# EAGLE design LUMINA BOARD (EAGLE 7.5.0)
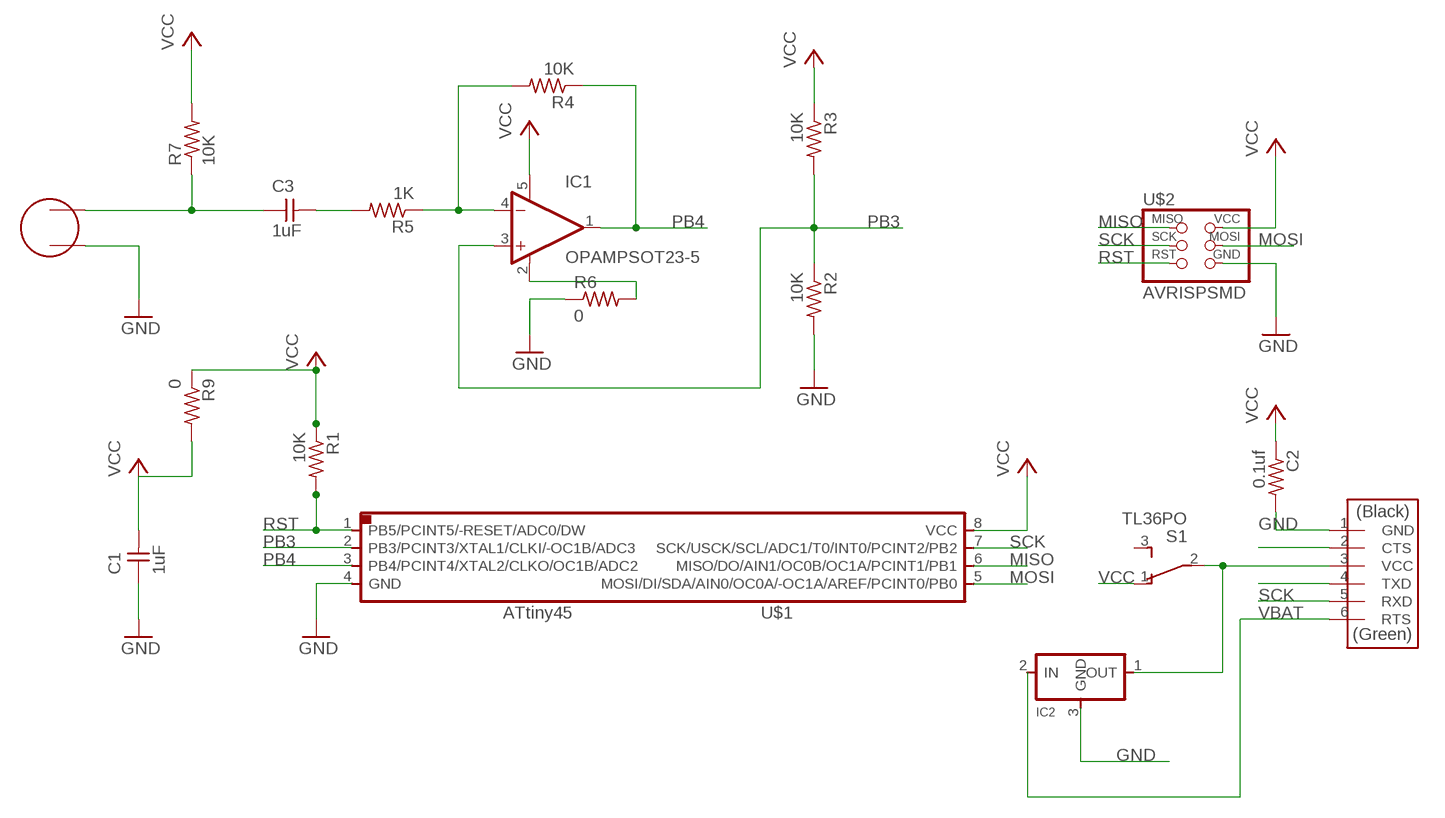
[diagram p0: schematic, sheet 1]

## Parts
C1  1uF  UNPOLARIZED_CAPACITOR1206  [1206]
C2  0.1uf  RESISTOR1206  [1206]
C3  1uF  UNPOLARIZED_CAPACITOR1206  [1206]
IC1  OPAMPSOT23-5  [SOT23-5]
IC2  REGULATORSOT23  [SOT23]
R1  10K  RESISTOR1206  [1206]
R2  10K  RESISTOR1206  [1206]
R3  10K  RESISTOR1206  [1206]
R4  10K  RESISTOR1206  [1206]
R5  1K  RESISTOR1206  [1206]
R6  0  RESISTOR1206  [1206]
R7  10K  RESISTOR1206  [1206]
R9  0  RESISTOR1206  [1206]
S1  TL36PO  [TL3XPO]
U$1  ATTINY45SI  [SOIC8]
U$2  AVRISPSMD  [2X03SMD]
U$3  FTDI-SMD-HEADER  [1X06SMD]
U$4  ELECTRET  [ELECTRET_2742PBJ-A]

## Nets
GND: C1.1 C2.2 IC2.3(GND) R2.2 R6.1 U$1.4(GND) U$2.6(GND) U$3.1(GND) U$4.P$1
MISO: U$1.6(MISO/DO/AIN1/OC0B/OC1A/PCINT1/PB1) U$2.1(MISO)
MOSI: U$1.5(MOSI/DI/SDA/AIN0/OC0A/-OC1A/AREF/PCINT0/PB0) U$2.4(MOSI)
N$1: C3.1 R7.1 U$4.P$2
N$2: C3.2 R5.2
N$3: IC1.4(-IN) R4.2 R5.1
N$5: IC1.2(V-) R6.2
N$6: U$3.2(CTS)
N$7: IC2.1(OUT) S1.2(P) U$3.3(VCC)
N$8: U$3.4(TXD)
PB3: IC1.3(+IN) R2.1 R3.2 U$1.2(PB3/PCINT3/XTAL1/CLKI/-OC1B/ADC3)
PB4: IC1.1(OUT) R4.1 U$1.3(PB4/PCINT4/XTAL2/CLKO/OC1B/ADC2)
RST: R1.2 U$1.1(PB5/PCINT5/-RESET/ADC0/DW) U$2.5(RST)
SCK: U$1.7(SCK/USCK/SCL/ADC1/T0/INT0/PCINT2/PB2) U$2.3(SCK) U$3.5(RXD)
VBAT: IC2.2(IN) U$3.6(RTS)
VCC: C1.2 C2.1 IC1.5(V+) R1.1 R3.1 R7.2 R9.1 R9.2 S1.1(O) U$1.8(VCC) U$2.2(VCC)
Unconnected: S1.3(S)

## Library data of the parts
C1 C3 = 01_FAB_Hello:UNPOLARIZED_CAPACITOR: unpolarized_capacitor
C2 R1-R7 R9 = 01_FAB_Hello:RESISTOR
IC1 = fab:OPAMP: Rail-to-Rail Operational Amplifiers Single-Supply, MicroAmplifier(TM) Series
IC2 = fab:REGULATOR
S1 = switch:TL36PO: TINY SWITCH ON - ON Source: http://www2.produktinfo.conrad.com/datenblaetter/700000-724999/705152-da-01-de-Subminiaturschalter_TL_36YO.pdf
U$1 = 01_fab:ATTINY45
U$2 = 01_FAB_Hello:AVRISP
U$3 = fab:FTDI-SMD-HEADER
U$4 = fab:ELECTRET

## Board
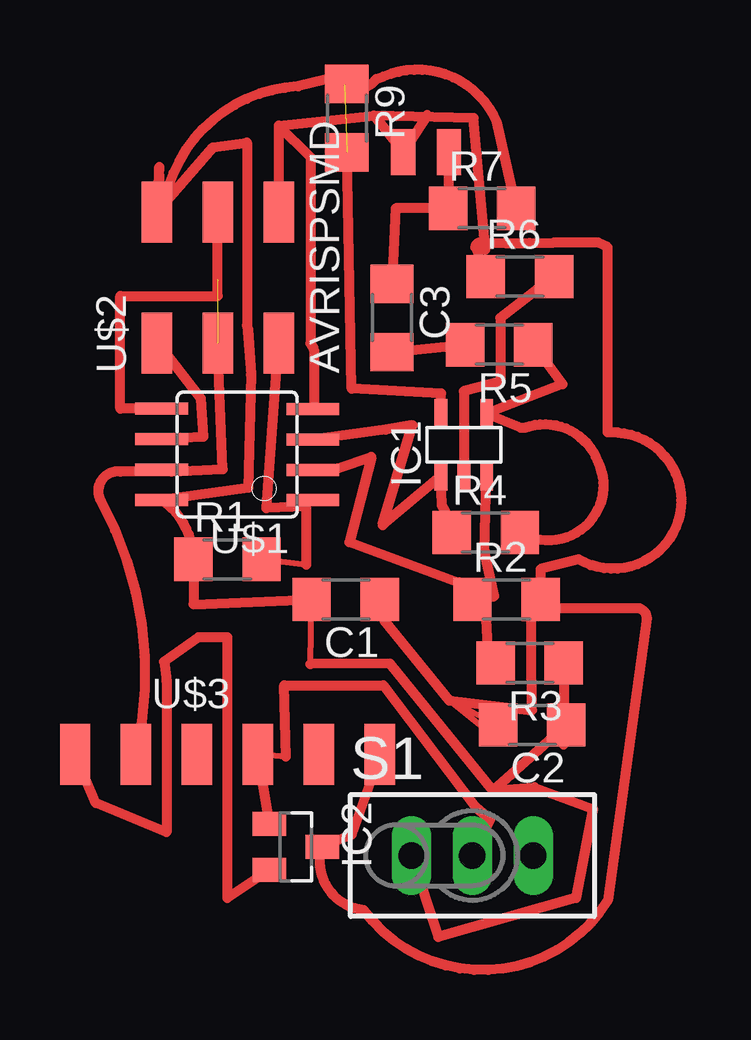
[diagram p1: board, top side]

No outline drawn. Coordinates in mm, seen from the top.
Copper layers (1*16): Top 0.035mm / dielectric 1.5mm / Bottom 0.035mm
Design rules "default *": minimum track width 10mil, minimum drill 24mil, track to track 11mil, track to pad 11mil, pad to pad 11mil, via to via 11mil, smd to smd 11mil, copper to edge 40mil, drill to drill 8mil, minimum pad ring 10mil, minimum via ring 8mil, stop-mask expansion 4mil, vias tented up to drill 0mil, thermal gap 10mil

### Footprints (pad centres in the part's own frame; a part is rotated, then mirrored left to right if it is on the bottom)
1206 = smd 1.6 x 1.803: 1 -1.422,0; 2 1.422,0
SOT23-5 = smd 0.533 x 1.194: 1 -0.95,-1.306; 2 0,-1.306; 3 0.95,-1.306; 4 0.95,1.306; 5 -0.95,1.306
SOT23 = smd 1 x 1.4: 1 -0.95,-1.1; 2 0.95,-1.1; 3 0,1.1
TL3XPO = drill 1.1 pad 1.422 long: 1 -2.54,0; 2 0,0; 3 2.54,0
SOIC8 = smd 0.5 x 2.2: 1 -1.905,-3.154; 2 -0.645,-3.154; 3 0.625,-3.154; 4 1.895,-3.154; 5 1.905,3.154; 6 0.635,3.154; 7 -0.635,3.154; 8 -1.905,3.154
2X03SMD = smd 2.54 x 1.27: 1 -2.54,2.54; 2 2.92,2.54; 3 -2.54,0; 4 2.92,0; 5 -2.54,-2.54; 6 2.92,-2.54
1X06SMD = smd 2.54 x 1.27: 1 0,6.35; 2 0,3.81; 3 0,1.27; 4 0,-1.27; 5 0,-3.81; 6 0,-6.35
ELECTRET_2742PBJ-A = smd 1.016 x 1.905: P$1 -0.953,0; P$2 0.953,0

### Placement (x,y rotation side)
C1  72.39,37.74 180 top
C2  80.16,32.51 180 top
C3  74.32,49.48 270 top
IC1  77.32,44.2 0 top
IC2  70.31,27.43 270 top
R1  67.46,39.42 0 top
R2  79.1,37.74 0 top
R3  80.06,35.1 180 top
R4  78.23,40.54 0 top
R5  78.79,48.36 180 top
R6  79.65,51.21 0 top
R7  78.08,54.05 0 top
R9  72.44,57.81 270 top
S1  77.67,27.08 0 top
U$1  67.87,43.79 90 top
U$2  67.06,50.98 90 top
U$3  67.46,31.29 270 top
U$4  75.74,56.39 0 top

### Tracks (layer width: path | path; a pad name or v marks a point on that pad's centre or on a via)
GND
  Top 0.254: 73.99,36.88 C1.1 | 71.07,45.85 U$1.4 | 80.31,38.05 80.11,38.15 R2.2 | 78.66,31.98 76.71,33.53 C2.2 78.66,31.98
  Top 0.406: 69.6,57.51 73.57,57.91 | 73.57,57.91 U$4.P$1 75.79,57.94 | 73.99,36.88 76.71,33.53 80.16,33.12 80.11,38.15 | 77.8,52.43 R6.1 | 71.07,45.85 71.07,48.16 70.92,48.41 70.92,56.19 69.6,57.51 | 77.8,52.43 78.21,52.32 77.72,57.81 73.57,57.91 | 69.6,57.51 U$2.6 | U$3.1 72.64,27.94 IC2.3 arc101 73.15,24.79 arc112 83.31,25.2 84.94,36.98 arc90 84.53,37.39 80.87,37.39 arc-90 R2.2 80.52,39.01 82.09,39.42 arc207 83.72,44.7 83.31,44.7 83.31,52.43 82.91,52.63 81.08,52.63 arc-5 78,52.63 arc90 77.8,52.43
MISO
  Top 0.406: U$2.1 64.92,47.95 66.34,46.13 66.45,44.53 U$1.6
MOSI
  Top 0.406: U$1.5 62.99,45.7 62.99,50.39 67.06,50.39 U$2.4
N$1
  Top 0.406: U$4.P$2 R7.1 74.47,54.05 C3.1
N$2
  Top 0.406: C3.2 R5.2
N$3
  Top 0.406: R5.1 81.43,46.72 IC1.4 79.69,44.91 79.86,44.91 arc-90 82.91,43.48 arc-147 R4.2
N$5
  Top 0.406: R6.2 78.84,49.48 78.84,46.84 77.32,46.43 IC1.2
N$7
  Top 0.254: 69.9,31.19 U$3.3
  Top 0.406: S1.2 78.41,28.57 77.8,29.11 73.97,34.16 69.83,34.16 69.9,31.19 | IC2.1 U$3.3
PB3
  Top 0.254: 77.75,37.85 R2.1 | 78.23,36.93 77.34,37.92 R2.1 | 78.33,34.95 R3.2 | 72.06,43.2 71.07,43.2 U$1.2 | 77.11,38.46 R2.1
  Top 0.406: 77.75,37.85 78.59,37.87 78.18,39.78 IC1.3 | 78.23,36.93 78.33,34.95 | 72.06,43.2 73.46,43.69 72.54,40.13 77.11,38.46
PB4
  Top 0.406: R4.1 76.4,40.23 77.22,40.23 76.4,41.67 IC1.1 73.93,40.84 75.18,45.01 74.07,44.82 U$1.3
RST
  Top 0.254: 70.74,39.19 R1.2 | 70.74,41.88 U$1.1
  Top 0.406: 70.74,41.88 70.74,41.63 | 70.74,41.63 70.74,39.19 | U$2.5 69.09,41.55 70.74,41.63
SCK  (1 unrouted)
  Top 0.406: U$1.7 65.12,43.08 | 65.12,43.08 67.26,43.18 U$2.3 | 65.12,43.08 62.99,43.08 arc126 62.18,41.86 arc-41 U$3.5
VBAT
  Top 0.406: IC2.2 67.46,25.3 67.46,36.17 66.24,36.17 64.82,35.15 64.92,34.34 64.92,28.04 61.98,29.26 U$3.6
VCC  (1 unrouted)
  Top 0.254: 70.92,35.05 C1.2
  Top 0.406: R3.1 81.48,31.7 C2.1 78.54,29.79 | 78.54,29.79 80.26,29.92 82.7,29.01 81.99,25.3 76.25,23.67 S1.1 | C1.2 66.04,37.54 R1.1 arc57 U$1.8 68.33,42.39 68.44,47.11 | 70.92,35.05 74.24,35.08 78.54,29.79 | 68.33,49 68.44,47.11 | IC1.5 76.37,46.33 72.64,46.53 R9.2 | 68.44,47.11 68.28,49.17 68.28,56.79 66.85,56.59 U$2.2 64.62,55.78 64.72,52.83 arc-90 70.41,59.13 72.06,59.54 arc90 72.34,59.21 R9.1 arc90 73.66,59.44 73.97,59.54 arc-90 78.69,57.66 R7.2